# EAGLE schematic prva_shema (EAGLE 7.2.0)
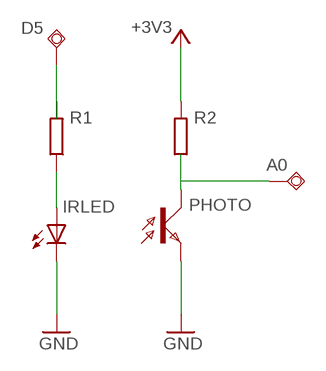
[diagram p0: schematic, sheet 1]

## Parts
A0  TPSQB1,27  [B1,27]
D5  TPSQB1,27  [B1,27]
IRLED  SFH482  [SFH482]
PHOTO  BPX81  [BPX81]
R1  R-EU_0204/5  [0204/5]
R2  R-EU_0204/5  [0204/5]

## Nets
+3V3: R2.2
GND: IRLED.K(C) PHOTO.E
N$1: IRLED.A R1.1
N$2: A0.TP PHOTO.C R2.1
N$3: D5.TP R1.2

## Library data of the parts
A0 D5 = testpad:TPSQ: Test pad
IRLED = led:SFH482: IR LED infrared emitting diode, Infineon
PHOTO = opto-trans-siemens:BPX81: PHOTO TRANSISTOR; OC_FARNELL: unknown; OC_NEWARK: unknown
R1 R2 = rcl:R-EU_: RESISTOR, European symbol